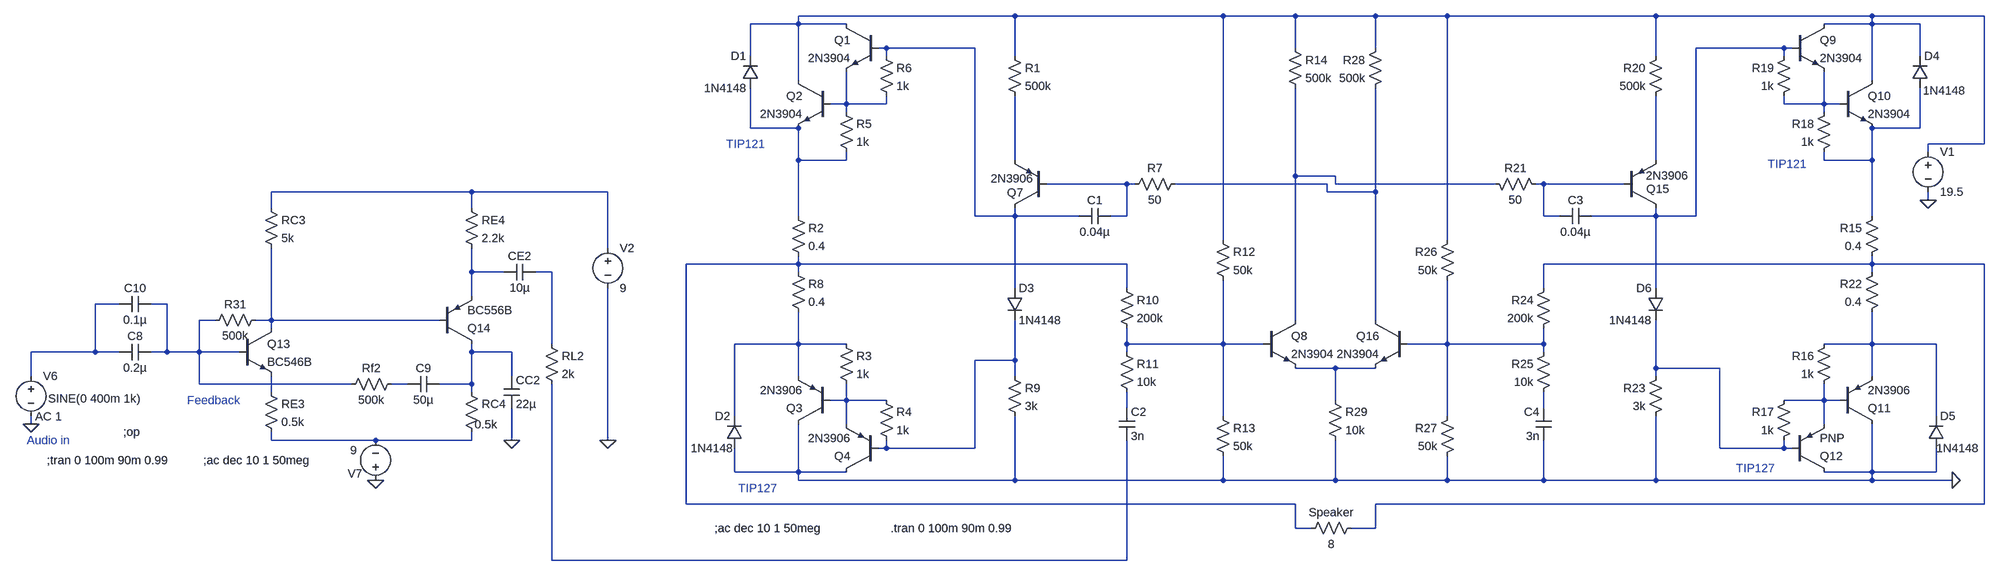
[diagram p0: schematic Project_ouput_stage (3).asc]
Project_ouput_stage (3).asc, the LTspice schematic file:
Version 4
SHEET 1 2388 1240
WIRE 448 96 16 96
WIRE 864 96 448 96
WIRE 1008 96 864 96
WIRE 1168 96 1008 96
WIRE 1312 96 1168 96
WIRE 1728 96 1312 96
WIRE 2160 96 1728 96
WIRE 2384 96 2160 96
WIRE 16 112 16 96
WIRE 16 112 -80 112
WIRE 112 112 16 112
WIRE 2160 112 2160 96
WIRE 2160 112 2064 112
WIRE 2256 112 2160 112
WIRE 192 160 176 160
WIRE 368 160 192 160
WIRE 1008 160 1008 96
WIRE 1168 160 1168 96
WIRE 1984 160 1808 160
WIRE 2000 160 1984 160
WIRE -80 176 -80 112
WIRE 192 176 192 160
WIRE 448 176 448 96
WIRE 1728 176 1728 96
WIRE 1984 176 1984 160
WIRE 2256 176 2256 112
WIRE 16 224 16 112
WIRE 2160 224 2160 112
WIRE 112 272 112 208
WIRE 112 272 80 272
WIRE 192 272 192 256
WIRE 192 272 112 272
WIRE 1984 272 1984 256
WIRE 2064 272 2064 208
WIRE 2064 272 1984 272
WIRE 2096 272 2064 272
WIRE 112 288 112 272
WIRE 2064 288 2064 272
WIRE -80 320 -80 240
WIRE 16 320 -80 320
WIRE 2256 320 2256 240
WIRE 2256 320 2160 320
WIRE 2384 352 2384 96
WIRE 2384 352 2272 352
WIRE 2272 368 2272 352
WIRE 16 384 16 320
WIRE 112 384 112 368
WIRE 112 384 16 384
WIRE 448 384 448 256
WIRE 1728 384 1728 256
WIRE 2064 384 2064 368
WIRE 2160 384 2160 320
WIRE 2160 384 2064 384
WIRE 1008 416 1008 240
WIRE 1088 416 1008 416
WIRE 672 432 512 432
WIRE 688 432 672 432
WIRE 1072 432 768 432
WIRE 1088 432 1088 416
WIRE 1408 432 1088 432
WIRE 1504 432 1488 432
WIRE 1664 432 1504 432
WIRE -720 448 -1120 448
WIRE -448 448 -720 448
WIRE 1072 448 1072 432
WIRE 1168 448 1168 240
WIRE 1168 448 1072 448
WIRE 2272 464 2272 448
WIRE -1120 480 -1120 448
WIRE -720 480 -720 448
WIRE 16 496 16 384
WIRE 368 496 368 160
WIRE 448 496 448 480
WIRE 448 496 368 496
WIRE 576 496 448 496
WIRE 672 496 672 432
WIRE 672 496 640 496
WIRE 1504 496 1504 432
WIRE 1536 496 1504 496
WIRE 1728 496 1728 480
WIRE 1728 496 1600 496
WIRE 1808 496 1808 160
WIRE 1808 496 1728 496
WIRE 2160 496 2160 384
WIRE 864 544 864 96
WIRE 1312 544 1312 96
WIRE -448 560 -448 448
WIRE 16 592 16 576
WIRE 16 592 -208 592
WIRE 672 592 16 592
WIRE 2160 592 2160 576
WIRE 2160 592 1504 592
WIRE 2384 592 2160 592
WIRE -720 608 -720 560
WIRE -656 608 -720 608
WIRE -560 608 -592 608
WIRE 16 608 16 592
WIRE 2160 608 2160 592
WIRE 448 640 448 496
WIRE 672 640 672 592
WIRE 1504 640 1504 592
WIRE 1728 640 1728 496
WIRE -720 656 -720 608
WIRE -1424 672 -1472 672
WIRE -1328 672 -1360 672
WIRE -1232 704 -1264 704
WIRE -1120 704 -1120 560
WIRE -1120 704 -1152 704
WIRE -784 704 -1120 704
WIRE 1008 704 1008 416
WIRE 1168 704 1168 448
WIRE -1120 720 -1120 704
WIRE -560 752 -560 608
WIRE 16 752 16 688
WIRE 16 752 -112 752
WIRE 112 752 16 752
WIRE 672 752 672 720
WIRE 864 752 864 624
WIRE 864 752 672 752
WIRE 944 752 864 752
WIRE 1312 752 1312 624
WIRE 1312 752 1232 752
WIRE 1504 752 1504 720
WIRE 1504 752 1312 752
WIRE 2160 752 2160 688
WIRE 2160 752 2064 752
WIRE 2288 752 2160 752
WIRE -1472 768 -1472 672
WIRE -1472 768 -1600 768
WIRE -1424 768 -1472 768
WIRE -1328 768 -1328 672
WIRE -1328 768 -1360 768
WIRE -1264 768 -1264 704
WIRE -1264 768 -1328 768
WIRE -1184 768 -1264 768
WIRE -720 768 -720 752
WIRE -640 768 -720 768
WIRE 672 768 672 752
WIRE 1504 768 1504 752
WIRE 448 784 448 704
WIRE 448 784 368 784
WIRE 1088 800 1008 800
WIRE 1168 800 1088 800
WIRE 1728 800 1728 704
WIRE 1856 800 1728 800
WIRE -1600 816 -1600 768
WIRE -640 816 -640 768
WIRE 16 816 16 752
WIRE 448 816 448 784
WIRE 1728 816 1728 800
WIRE 2160 816 2160 752
WIRE -1264 832 -1264 768
WIRE -960 832 -1264 832
WIRE -848 832 -880 832
WIRE -720 832 -720 768
WIRE -720 832 -784 832
WIRE -1120 848 -1120 816
WIRE -720 848 -720 832
WIRE 112 864 112 832
WIRE 112 864 80 864
WIRE 192 864 112 864
WIRE 1088 864 1088 800
WIRE 2064 864 2064 832
WIRE 2064 864 1984 864
WIRE 2096 864 2064 864
WIRE 672 880 672 848
WIRE 1504 880 1504 848
WIRE -112 896 -112 752
WIRE 864 896 864 752
WIRE 1312 896 1312 752
WIRE 2288 896 2288 752
WIRE -1600 912 -1600 896
WIRE 112 912 112 864
WIRE 2064 912 2064 864
WIRE -1120 944 -1120 928
WIRE -912 944 -1120 944
WIRE -720 944 -720 928
WIRE -720 944 -912 944
WIRE -640 944 -640 880
WIRE -448 944 -448 640
WIRE 192 960 192 944
WIRE 192 960 176 960
WIRE 368 960 368 784
WIRE 368 960 192 960
WIRE 1856 960 1856 800
WIRE 1984 960 1984 944
WIRE 1984 960 1856 960
WIRE 2000 960 1984 960
WIRE -112 1008 -112 960
WIRE 16 1008 16 912
WIRE 16 1008 -112 1008
WIRE 112 1008 16 1008
WIRE 2160 1008 2160 912
WIRE 2160 1008 2064 1008
WIRE 2288 1008 2288 960
WIRE 2288 1008 2160 1008
WIRE 16 1024 16 1008
WIRE 448 1024 448 896
WIRE 448 1024 16 1024
WIRE 864 1024 864 976
WIRE 864 1024 448 1024
WIRE 1088 1024 1088 944
WIRE 1088 1024 864 1024
WIRE 1312 1024 1312 976
WIRE 1312 1024 1088 1024
WIRE 1504 1024 1504 944
WIRE 1504 1024 1312 1024
WIRE 1728 1024 1728 896
WIRE 1728 1024 1504 1024
WIRE 2160 1024 2160 1008
WIRE 2160 1024 1728 1024
WIRE 2320 1024 2160 1024
WIRE -208 1072 -208 592
WIRE 1008 1072 -208 1072
WIRE 2384 1072 2384 592
WIRE 2384 1072 1168 1072
WIRE 1008 1120 1008 1072
WIRE 1040 1120 1008 1120
WIRE 1168 1120 1168 1072
WIRE 1168 1120 1120 1120
WIRE -560 1184 -560 832
WIRE 672 1184 672 944
WIRE 672 1184 -560 1184
FLAG 2272 464 0
FLAG 2320 1024 0
FLAG -1600 912 0
FLAG -912 1024 0
FLAG -640 944 0
FLAG -448 944 0
SYMBOL diode -64 240 R180
WINDOW 0 24 64 Left 2
WINDOW 3 24 0 Left 2
SYMATTR InstName D1
SYMATTR Value 1N4148
SYMBOL npn 176 112 M0
SYMATTR InstName Q1
SYMATTR Value 2N3904
SYMBOL npn 80 224 M0
SYMATTR InstName Q2
SYMATTR Value 2N3904
SYMBOL pnp 80 912 R180
SYMATTR InstName Q3
SYMATTR Value 2N3906
SYMBOL pnp 176 1008 R180
SYMATTR InstName Q4
SYMATTR Value 2N3906
SYMBOL diode -96 960 R180
WINDOW 0 24 64 Left 2
WINDOW 3 18 0 Left 2
SYMATTR InstName D2
SYMATTR Value 1N4148
SYMBOL res 0 480 R0
SYMATTR InstName R2
SYMATTR Value 0.4
SYMBOL res 96 736 R0
SYMATTR InstName R3
SYMATTR Value 1k
SYMBOL res 176 848 R0
SYMATTR InstName R4
SYMATTR Value 1k
SYMBOL res 96 272 R0
SYMATTR InstName R5
SYMATTR Value 1k
SYMBOL res 176 160 R0
SYMATTR InstName R6
SYMATTR Value 1k
SYMBOL pnp 512 480 R180
WINDOW 0 47 31 Left 2
WINDOW 3 27 59 Left 2
SYMATTR InstName Q7
SYMATTR Value 2N3906
SYMBOL res 432 160 R0
SYMATTR InstName R1
SYMATTR Value 500k
SYMBOL cap 640 480 R90
WINDOW 0 0 32 VBottom 2
WINDOW 3 32 32 VTop 2
SYMATTR InstName C1
SYMATTR Value 0.04µ
SYMBOL res 784 416 R90
WINDOW 0 0 56 VBottom 2
WINDOW 3 32 56 VTop 2
SYMATTR InstName R7
SYMATTR Value 50
SYMBOL diode 432 640 R0
SYMATTR InstName D3
SYMATTR Value 1N4148
SYMBOL res 0 592 R0
SYMATTR InstName R8
SYMATTR Value 0.4
SYMBOL res 432 800 R0
SYMATTR InstName R9
SYMATTR Value 3k
SYMBOL res 656 624 R0
SYMATTR InstName R10
SYMATTR Value 200k
SYMBOL res 656 752 R0
SYMATTR InstName R11
SYMATTR Value 10k
SYMBOL res 848 528 R0
SYMATTR InstName R12
SYMATTR Value 50k
SYMBOL cap 656 880 R0
SYMATTR InstName C2
SYMATTR Value 3n
SYMBOL res 848 880 R0
SYMATTR InstName R13
SYMATTR Value 50k
SYMBOL res 992 144 R0
SYMATTR InstName R14
SYMATTR Value 500k
SYMBOL npn 944 704 R0
SYMATTR InstName Q8
SYMATTR Value 2N3904
SYMBOL diode 2240 240 M180
WINDOW 0 24 64 Left 2
WINDOW 3 22 -5 Left 2
SYMATTR InstName D4
SYMATTR Value 1N4148
SYMBOL npn 2000 112 R0
SYMATTR InstName Q9
SYMATTR Value 2N3904
SYMBOL npn 2096 224 R0
SYMATTR InstName Q10
SYMATTR Value 2N3904
SYMBOL pnp 2096 912 M180
SYMATTR InstName Q11
SYMATTR Value 2N3906
SYMBOL pnp 2000 1008 M180
SYMATTR InstName Q12
SYMBOL diode 2272 960 M180
WINDOW 0 24 64 Left 2
WINDOW 3 16 0 Left 2
SYMATTR InstName D5
SYMATTR Value 1N4148
SYMBOL res 2176 480 M0
SYMATTR InstName R15
SYMATTR Value 0.4
SYMBOL res 2080 736 M0
SYMATTR InstName R16
SYMATTR Value 1k
SYMBOL res 2000 848 M0
SYMATTR InstName R17
SYMATTR Value 1k
SYMBOL res 2080 272 M0
SYMATTR InstName R18
SYMATTR Value 1k
SYMBOL res 2000 160 M0
SYMATTR InstName R19
SYMATTR Value 1k
SYMBOL pnp 1664 480 M180
WINDOW 0 45 38 Left 2
WINDOW 3 44 65 Left 2
SYMATTR InstName Q15
SYMATTR Value 2N3906
SYMBOL res 1744 160 M0
SYMATTR InstName R20
SYMATTR Value 500k
SYMBOL cap 1536 480 M90
WINDOW 0 0 32 VBottom 2
WINDOW 3 32 32 VTop 2
SYMATTR InstName C3
SYMATTR Value 0.04µ
SYMBOL res 1392 416 M90
WINDOW 0 0 56 VBottom 2
WINDOW 3 32 56 VTop 2
SYMATTR InstName R21
SYMATTR Value 50
SYMBOL diode 1744 640 M0
SYMATTR InstName D6
SYMATTR Value 1N4148
SYMBOL res 2176 592 M0
SYMATTR InstName R22
SYMATTR Value 0.4
SYMBOL res 1744 800 M0
SYMATTR InstName R23
SYMATTR Value 3k
SYMBOL res 1520 624 M0
SYMATTR InstName R24
SYMATTR Value 200k
SYMBOL res 1520 752 M0
SYMATTR InstName R25
SYMATTR Value 10k
SYMBOL res 1328 528 M0
SYMATTR InstName R26
SYMATTR Value 50k
SYMBOL cap 1520 880 M0
SYMATTR InstName C4
SYMATTR Value 3n
SYMBOL res 1328 880 M0
SYMATTR InstName R27
SYMATTR Value 50k
SYMBOL res 1184 144 M0
SYMATTR InstName R28
SYMATTR Value 500k
SYMBOL npn 1232 704 M0
SYMATTR InstName Q16
SYMATTR Value 2N3904
SYMBOL res 1136 1104 R90
WINDOW 0 0 56 VBottom 2
WINDOW 3 32 56 VTop 2
SYMATTR InstName Speaker
SYMATTR Value 8
SYMBOL voltage 2272 352 R0
WINDOW 123 0 0 Left 0
WINDOW 39 0 0 Left 0
SYMATTR InstName V1
SYMATTR Value 19.5
SYMBOL res 1072 848 R0
SYMATTR InstName R29
SYMATTR Value 10k
SYMBOL cap -1360 752 R90
WINDOW 0 0 32 VBottom 2
WINDOW 3 32 32 VTop 2
SYMATTR InstName C8
SYMATTR Value 0.2µ
SYMBOL res -1136 464 R0
SYMATTR InstName RC3
SYMATTR Value 5k
SYMBOL npn -1184 720 R0
SYMATTR InstName Q13
SYMATTR Value BC546B
SYMBOL res -1136 832 R0
SYMATTR InstName RE3
SYMATTR Value 0.5k
SYMBOL res -736 464 R0
SYMATTR InstName RE4
SYMATTR Value 2.2k
SYMBOL cap -592 592 R90
WINDOW 0 0 32 VBottom 2
WINDOW 3 32 32 VTop 2
SYMATTR InstName CE2
SYMATTR Value 10µ
SYMBOL cap -656 816 R0
SYMATTR InstName CC2
SYMATTR Value 22µ
SYMBOL res -736 832 R0
WINDOW 3 22 81 Left 2
SYMATTR Value 0.5k
SYMATTR InstName RC4
SYMBOL voltage -448 544 R0
WINDOW 123 0 0 Left 0
WINDOW 39 0 0 Left 0
SYMATTR InstName V2
SYMATTR Value 9
SYMBOL voltage -1600 800 R0
WINDOW 123 8 97 Left 2
WINDOW 39 0 0 Left 0
WINDOW 3 34 61 Left 2
SYMATTR Value2 AC 1
SYMATTR Value SINE(0 400m 1k)
SYMATTR InstName V6
SYMBOL res -864 816 R90
WINDOW 0 0 56 VBottom 2
WINDOW 3 32 56 VTop 2
SYMATTR InstName Rf2
SYMATTR Value 500k
SYMBOL res -576 736 R0
SYMATTR InstName RL2
SYMATTR Value 2k
SYMBOL cap -784 816 R90
WINDOW 0 0 32 VBottom 2
WINDOW 3 32 32 VTop 2
SYMATTR InstName C9
SYMATTR Value 50µ
SYMBOL voltage -912 1040 R180
WINDOW 0 26 29 Left 2
WINDOW 3 37 76 Left 2
WINDOW 123 0 0 Left 0
WINDOW 39 0 0 Left 0
SYMATTR InstName V7
SYMATTR Value 9
SYMBOL pnp -784 752 M180
SYMATTR InstName Q14
SYMATTR Value BC556B
SYMBOL res -1136 688 R90
WINDOW 0 0 56 VBottom 2
WINDOW 3 32 56 VTop 2
SYMATTR InstName R31
SYMATTR Value 500k
SYMBOL cap -1360 656 R90
WINDOW 0 0 32 VBottom 2
WINDOW 3 32 32 VTop 2
SYMATTR InstName C10
SYMATTR Value 0.1µ
TEXT -128 352 Left 2 ;TIP121
TEXT -104 1040 Left 2 ;TIP127
TEXT 1888 1000 Left 2 ;TIP127
TEXT 1952 392 Left 2 ;TIP121
TEXT 200 1120 Left 2 !.tran 0 100m 90m 0.99
TEXT -152 1120 Left 2 !;ac dec 10 1 50meg
TEXT -1288 864 Left 2 ;Feedback
TEXT -1608 944 Left 2 ;Audio in
TEXT -1416 928 Left 2 !;op
TEXT -1568 984 Left 2 !;tran 0 100m 90m 0.99
TEXT -1256 984 Left 2 !;ac dec 10 1 50meg

The netlist it stands for:
* Project_ouput_stage (3).asc
D1 N006 N001 1N4148
Q1 N001 N002 N004 0 2N3904
Q2 N001 N004 N006 0 2N3904
Q3 0 N032 N022 0 2N3906
Q4 0 N027 N032 0 2N3906
D2 0 N022 1N4148
R2 N006 N015 0.4
R3 N022 N032 1k
R4 N032 N027 1k
R5 N004 N006 1k
R6 N002 N004 1k
Q7 N002 N011 N008 0 2N3906
R1 N001 N008 500k
C1 N011 N002 0.04µ
R7 N012 N011 50
D3 N002 N027 1N4148
R8 N015 N022 0.4
R9 N027 0 3k
R10 N015 N023 200k
R11 N023 N034 10k
R12 N001 N023 50k
C2 N034 N037 3n
R13 N023 0 50k
R14 N001 N010 500k
Q8 N010 N023 N028 0 2N3904
D4 N007 N001 1N4148
Q9 N001 N003 N005 0 2N3904
Q10 N001 N005 N007 0 2N3904
Q11 0 N033 N025 0 2N3906
Q12 0 N029 N033 0 PNP
D5 0 N025 1N4148
R15 N007 N016 0.4
R16 N025 N033 1k
R17 N033 N029 1k
R18 N005 N007 1k
R19 N003 N005 1k
Q15 N003 N013 N009 0 2N3906
R20 N001 N009 500k
C3 N013 N003 0.04µ
R21 N010 N013 50
D6 N003 N029 1N4148
R22 N016 N025 0.4
R23 N029 0 3k
R24 N016 N024 200k
R25 N024 N035 10k
R26 N001 N024 50k
C4 N035 0 3n
R27 N024 0 50k
R28 N001 N012 500k
Q16 N012 N024 N028 0 2N3904
R§Speaker N016 N015 8
V1 N001 0 19.5
R29 N028 0 10k
C8 N020 N019 0.2µ
RC3 N014 N021 5k
Q13 N021 N020 N031 0 BC546B
RE3 N031 N036 0.5k
RE4 N014 N017 2.2k
CE2 N018 N017 10µ
CC2 N026 0 22µ
RC4 N026 N036 0.5k
V2 N014 0 9
V6 N019 0 SINE(0 400m 1k) AC 1
Rf2 N030 N020 500k
RL2 N018 N037 2k
C9 N026 N030 50µ
V7 0 N036 9
Q14 N026 N021 N017 0 BC556B
R31 N021 N020 500k
C10 N020 N019 0.1µ
.model D D
.lib standard.dio
.model NPN NPN
.model PNP PNP
.lib standard.bjt
* TIP121
* TIP127
* TIP127
* TIP121
.tran 0 100m 90m 0.99
;ac dec 10 1 50meg
* Feedback
* Audio in
;op
;tran 0 100m 90m 0.99
;ac dec 10 1 50meg
.backanno
.end